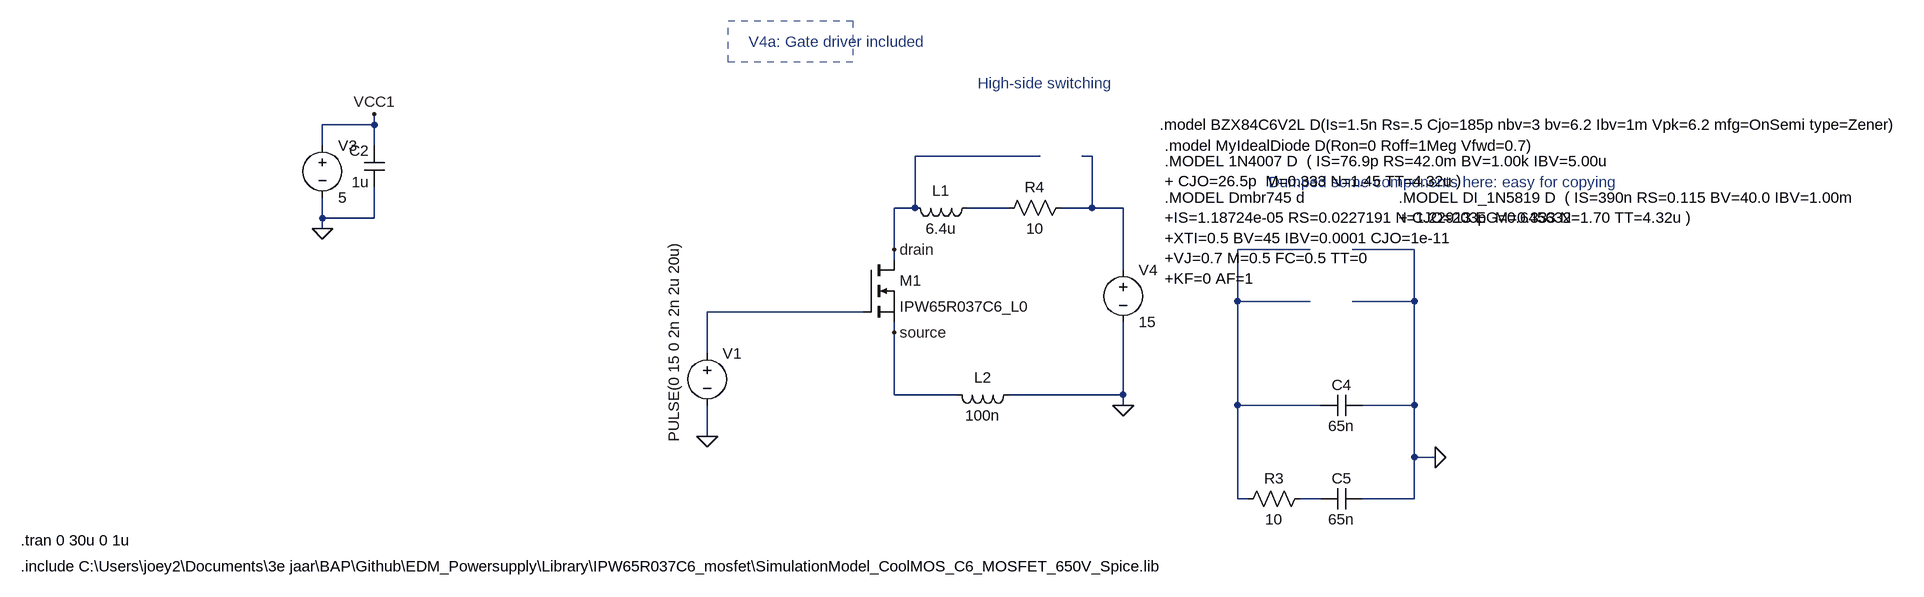
[diagram p0: schematic EDM_Powersupply_V4a_LSS.asc]
EDM_Powersupply_V4a_LSS.asc, the LTspice schematic file:
Version 4
SHEET 1 1876 680
WIRE -176 -160 -176 -176
WIRE -176 -160 -256 -160
WIRE -256 -128 -256 -160
WIRE -176 -128 -176 -160
WIRE 848 -112 656 -112
WIRE 928 -112 912 -112
WIRE 656 -32 656 -112
WIRE 656 -32 624 -32
WIRE 800 -32 736 -32
WIRE 928 -32 928 -112
WIRE 928 -32 880 -32
WIRE 976 -32 928 -32
WIRE -256 -16 -256 -48
WIRE -176 -16 -176 -64
WIRE -176 -16 -256 -16
WIRE -256 0 -256 -16
WIRE 624 32 624 -32
WIRE 1264 32 1152 32
WIRE 1424 32 1328 32
WIRE 624 48 624 32
WIRE 976 64 976 -32
WIRE 1152 112 1152 32
WIRE 1264 112 1152 112
WIRE 1424 112 1424 32
WIRE 1424 112 1328 112
WIRE 576 128 336 128
WIRE 624 160 624 144
WIRE 336 192 336 128
WIRE 624 256 624 160
WIRE 720 256 624 256
WIRE 976 256 976 144
WIRE 976 256 800 256
WIRE 976 272 976 256
WIRE 1152 272 1152 112
WIRE 1280 272 1152 272
WIRE 1424 272 1424 112
WIRE 1424 272 1344 272
WIRE 336 320 336 272
WIRE 1424 352 1424 272
WIRE 1456 352 1424 352
WIRE 1152 416 1152 272
WIRE 1168 416 1152 416
WIRE 1280 416 1248 416
WIRE 1424 416 1424 352
WIRE 1424 416 1344 416
FLAG 336 320 0
FLAG -256 0 0
FLAG -176 -176 VCC1
FLAG 624 32 drain
FLAG 624 160 source
FLAG 976 272 0
FLAG 1456 352 0
SYMBOL voltage 336 176 R0
WINDOW 123 0 0 Left 0
WINDOW 39 0 0 Left 0
WINDOW 3 -51 153 VLeft 2
SYMATTR Value PULSE(0 15 0 2n 2n 2u 20u)
SYMATTR InstName V1
SYMBOL cap -160 -64 R180
WINDOW 0 24 56 Left 2
WINDOW 3 24 8 Left 2
SYMATTR InstName C2
SYMATTR Value 1u
SYMBOL voltage -256 -144 R0
WINDOW 123 0 0 Left 0
WINDOW 39 0 0 Left 0
SYMATTR InstName V3
SYMATTR Value 5
SYMBOL res 896 -48 R90
WINDOW 0 0 56 VBottom 2
WINDOW 3 32 56 VTop 2
SYMATTR InstName R4
SYMATTR Value 10
SYMBOL voltage 976 48 R0
WINDOW 123 0 0 Left 0
WINDOW 39 0 0 Left 0
SYMATTR InstName V4
SYMATTR Value 15
SYMBOL nmos 576 48 R0
SYMATTR InstName M1
SYMATTR Value IPW65R037C6_L0
SYMATTR Prefix X
SYMBOL ind 752 -48 R90
WINDOW 0 5 56 VBottom 2
WINDOW 3 32 56 VTop 2
SYMATTR InstName L1
SYMATTR Value 6.4u
SYMATTR SpiceLine IC=0A
SYMBOL cap 1344 256 R90
WINDOW 0 0 32 VBottom 2
WINDOW 3 32 32 VTop 2
SYMATTR InstName C4
SYMATTR Value 65n
SYMBOL cap 1344 400 R90
WINDOW 0 0 32 VBottom 2
WINDOW 3 32 32 VTop 2
SYMATTR InstName C5
SYMATTR Value 65n
SYMBOL res 1264 400 R90
WINDOW 0 0 56 VBottom 2
WINDOW 3 32 56 VTop 2
SYMATTR InstName R3
SYMATTR Value 10
SYMBOL ind 816 240 R90
WINDOW 0 5 56 VBottom 2
WINDOW 3 32 56 VTop 2
SYMATTR InstName L2
SYMATTR Value 100n
TEXT -720 520 Left 2 !.include C:\\Users\\joey2\\Documents\\3e jaar\\BAP\\Github\\EDM_Powersupply\\Library\\IPW65R037C6_mosfet\\SimulationModel_CoolMOS_C6_MOSFET_650V_Spice.lib
TEXT -720 480 Left 2 !.tran 0 30u 0 1u
TEXT 752 -224 Left 2 ;High-side switching
TEXT 1200 -72 Left 2 ;Dumped some components here: easy for copying
TEXT 1032 -160 Left 2 !.model BZX84C6V2L D(Is=1.5n Rs=.5 Cjo=185p nbv=3 bv=6.2 Ibv=1m Vpk=6.2 mfg=OnSemi type=Zener)
TEXT 1040 -128 Left 2 !.model MyIdealDiode D(Ron=0 Roff=1Meg Vfwd=0.7)
TEXT 400 -288 Left 2 ;V4a: Gate driver included
TEXT 1040 -104 Left 2 !.MODEL 1N4007 D  ( IS=76.9p RS=42.0m BV=1.00k IBV=5.00u\n+ CJO=26.5p  M=0.333 N=1.45 TT=4.32u )
TEXT 1040 -48 Left 2 !.MODEL Dmbr745 d\n+IS=1.18724e-05 RS=0.0227191 N=1.22913 EG=0.645632\n+XTI=0.5 BV=45 IBV=0.0001 CJO=1e-11\n+VJ=0.7 M=0.5 FC=0.5 TT=0\n+KF=0 AF=1
TEXT 1400 -48 Left 2 !.MODEL DI_1N5819 D  ( IS=390n RS=0.115 BV=40.0 IBV=1.00m\n+ CJO=203p  M=0.333 N=1.70 TT=4.32u )
RECTANGLE Normal 560 -256 368 -320 2

The netlist it stands for:
* EDM_Powersupply_V4a_LSS.asc
V1 N004 0 PULSE(0 15 0 2n 2n 2u 20u)
C2 0 VCC1 1u
V3 VCC1 0 5
R4 N001 N002 10
V4 N001 0 15
XM1 drain N004 source IPW65R037C6_L0  ; pins D G S
L1 N002 drain 6.4u IC=0A
C4 0 N003 65n
C5 0 N005 65n
R3 N005 N003 10
L2 0 source 100n
.include C:\Users\joey2\Documents\3e jaar\BAP\Github\EDM_Powersupply\Library\IPW65R037C6_mosfet\SimulationModel_CoolMOS_C6_MOSFET_650V_Spice.lib
.tran 0 30u 0 1u
* High-side switching
* Dumped some components here: easy for copying
.model BZX84C6V2L D(Is=1.5n Rs=.5 Cjo=185p nbv=3 bv=6.2 Ibv=1m Vpk=6.2 mfg=OnSemi type=Zener)
.model MyIdealDiode D(Ron=0 Roff=1Meg Vfwd=0.7)
* V4a: Gate driver included
.MODEL 1N4007 D  ( IS=76.9p RS=42.0m BV=1.00k IBV=5.00u
+ CJO=26.5p  M=0.333 N=1.45 TT=4.32u )
.MODEL Dmbr745 d
+IS=1.18724e-05 RS=0.0227191 N=1.22913 EG=0.645632
+XTI=0.5 BV=45 IBV=0.0001 CJO=1e-11
+VJ=0.7 M=0.5 FC=0.5 TT=0
+KF=0 AF=1
.MODEL DI_1N5819 D  ( IS=390n RS=0.115 BV=40.0 IBV=1.00m
+ CJO=203p  M=0.333 N=1.70 TT=4.32u )
.backanno
.end